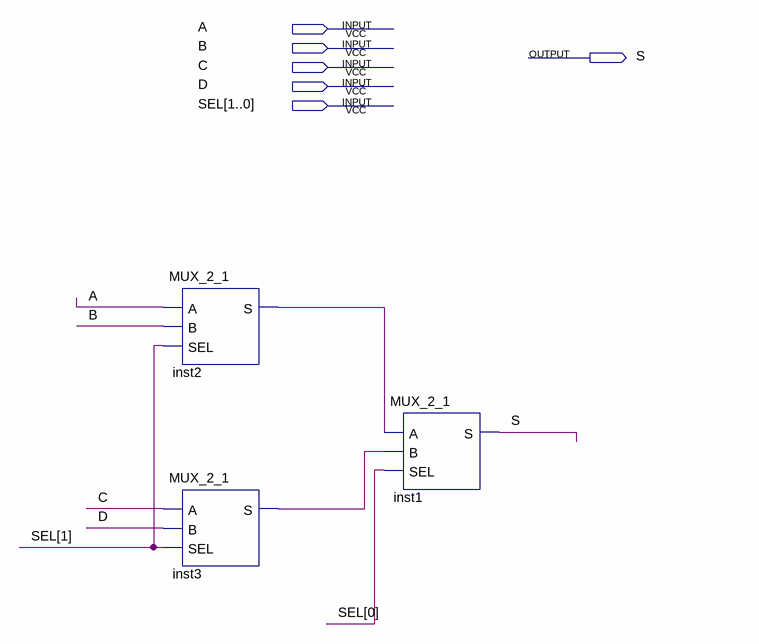
[diagram p0: schematic sheet]
// Quartus schematic mux_4_1.bdf as structural Verilog: 3 symbols, 6 pins
module mux_4_1 (
  input  A,
  input  B,
  input  C,
  input  D,
  input  [1:0] SEL,
  output S
);

  wire inst2_s, inst3_s;

  MUX_2_1 inst2 (.A(A), .B(B), .SEL(SEL[1]), .S(inst2_s));
  MUX_2_1 inst3 (.A(C), .B(D), .SEL(SEL[1]), .S(inst3_s));
  MUX_2_1 inst1 (.A(inst2_s), .B(inst3_s), .SEL(SEL[0]), .S(S));
endmodule
